# EAGLE design temp (EAGLE 7.1.0)
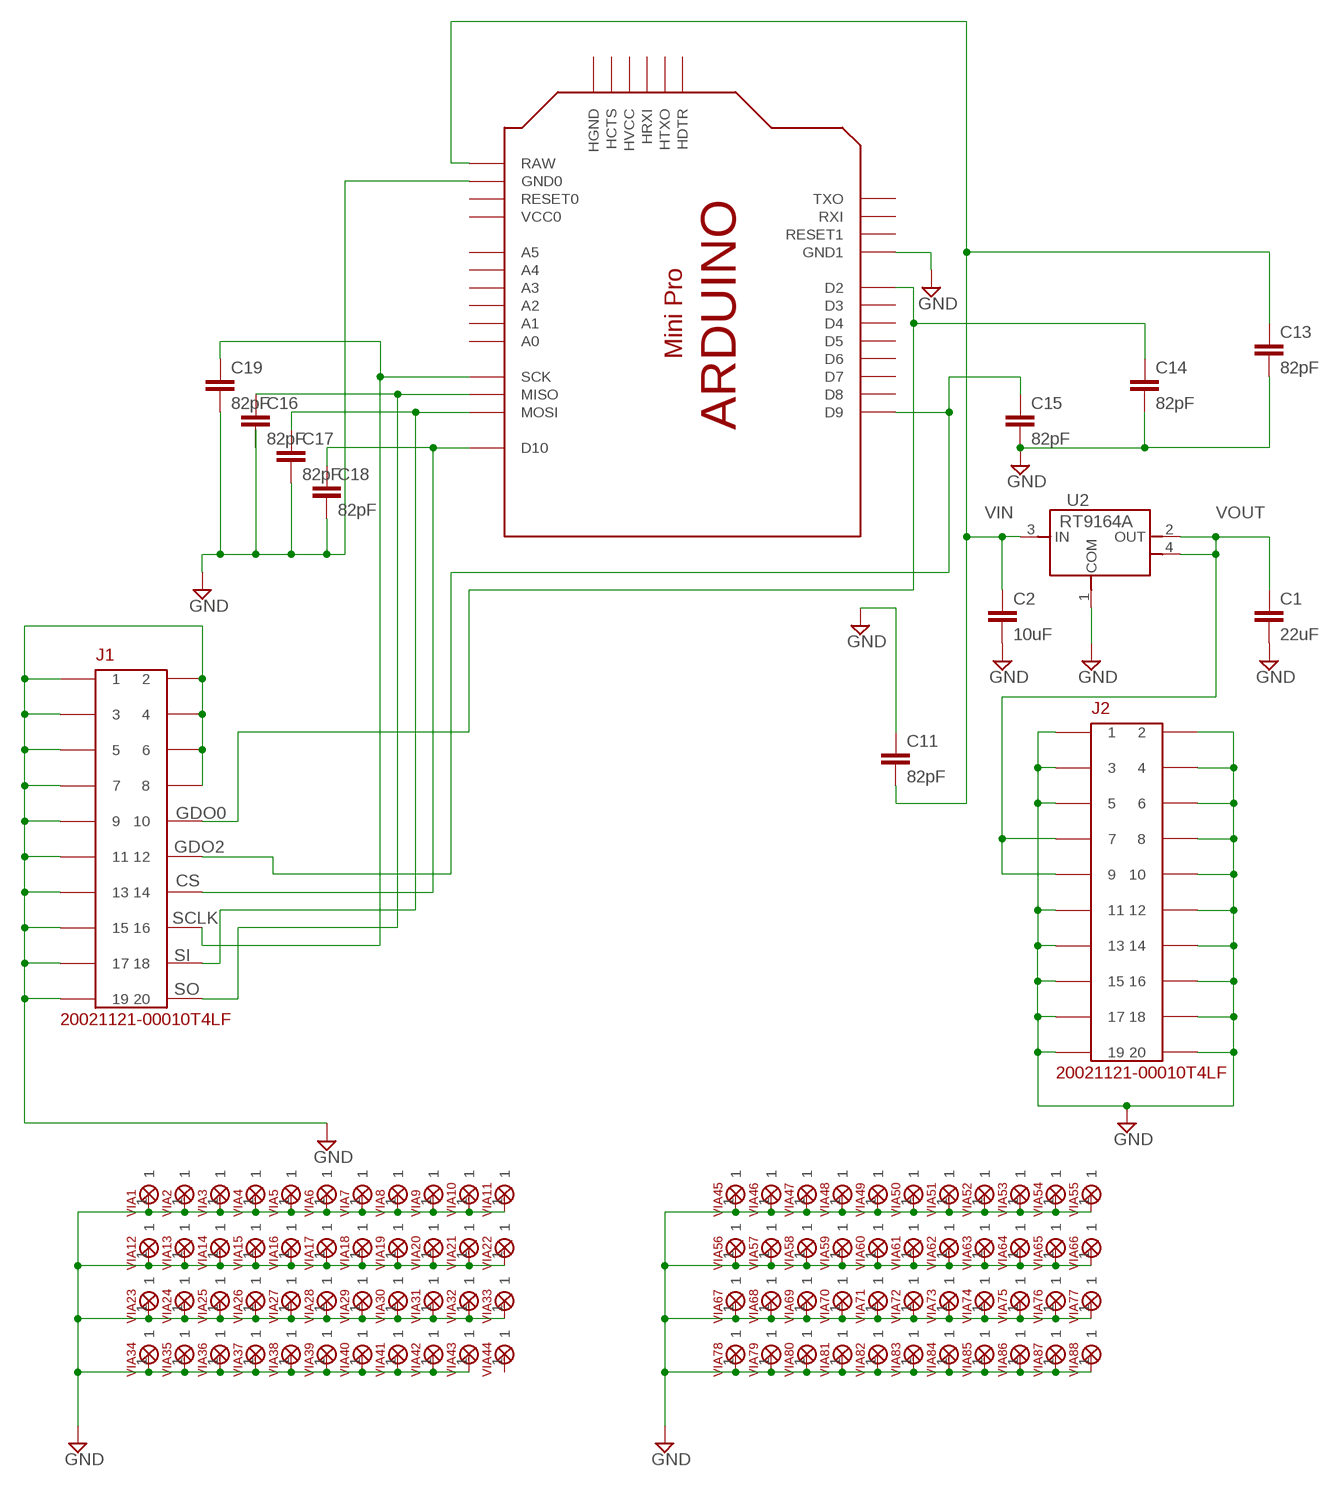
[diagram p0: schematic, sheet 1]

## Parts
C1  22uF  CC1206  [C1206]
C2  10uF  CC1206  [C1206]
C11  82pF  C  [C0805]
C13  82pF  C  [C0805]
C14  82pF  C  [C0805]
C15  82pF  C  [C0805]
C16  82pF  C  [C0805]
C17  82pF  C  [C0805]
C18  82pF  C  [C0805]
C19  82pF  C  [C0805]
J1  20021121-00010T4LF  [PINHDR10X2_50X50MIL_SMT]
J2  20021121-00010T4LF  [PINHDR10X2_50X50MIL_SMT]
U2  RT9164A  [TO223]
U$1  ARDUINOMINI  [ARDUINOMINI]
VIA1  GND_VIA_NO_THERMAL  [VIA_NO_THERMAL]
VIA2  GND_VIA_NO_THERMAL  [VIA_NO_THERMAL]
VIA3  GND_VIA_NO_THERMAL  [VIA_NO_THERMAL]
VIA4  GND_VIA_NO_THERMAL  [VIA_NO_THERMAL]
VIA5  GND_VIA_NO_THERMAL  [VIA_NO_THERMAL]
VIA6  GND_VIA_NO_THERMAL  [VIA_NO_THERMAL]
VIA7  GND_VIA_NO_THERMAL  [VIA_NO_THERMAL]
VIA8  GND_VIA_NO_THERMAL  [VIA_NO_THERMAL]
VIA9  GND_VIA_NO_THERMAL  [VIA_NO_THERMAL]
VIA10  GND_VIA_NO_THERMAL  [VIA_NO_THERMAL]
VIA11  GND_VIA_NO_THERMAL  [VIA_NO_THERMAL]
VIA12  GND_VIA_NO_THERMAL  [VIA_NO_THERMAL]
VIA13  GND_VIA_NO_THERMAL  [VIA_NO_THERMAL]
VIA14  GND_VIA_NO_THERMAL  [VIA_NO_THERMAL]
VIA15  GND_VIA_NO_THERMAL  [VIA_NO_THERMAL]
VIA16  GND_VIA_NO_THERMAL  [VIA_NO_THERMAL]
VIA17  GND_VIA_NO_THERMAL  [VIA_NO_THERMAL]
VIA18  GND_VIA_NO_THERMAL  [VIA_NO_THERMAL]
VIA19  GND_VIA_NO_THERMAL  [VIA_NO_THERMAL]
VIA20  GND_VIA_NO_THERMAL  [VIA_NO_THERMAL]
VIA21  GND_VIA_NO_THERMAL  [VIA_NO_THERMAL]
VIA22  GND_VIA_NO_THERMAL  [VIA_NO_THERMAL]
VIA23  GND_VIA_NO_THERMAL  [VIA_NO_THERMAL]
VIA24  GND_VIA_NO_THERMAL  [VIA_NO_THERMAL]
VIA25  GND_VIA_NO_THERMAL  [VIA_NO_THERMAL]
VIA26  GND_VIA_NO_THERMAL  [VIA_NO_THERMAL]
VIA27  GND_VIA_NO_THERMAL  [VIA_NO_THERMAL]
VIA28  GND_VIA_NO_THERMAL  [VIA_NO_THERMAL]
VIA29  GND_VIA_NO_THERMAL  [VIA_NO_THERMAL]
VIA30  GND_VIA_NO_THERMAL  [VIA_NO_THERMAL]
VIA31  GND_VIA_NO_THERMAL  [VIA_NO_THERMAL]
VIA32  GND_VIA_NO_THERMAL  [VIA_NO_THERMAL]
VIA33  GND_VIA_NO_THERMAL  [VIA_NO_THERMAL]
VIA34  GND_VIA_NO_THERMAL  [VIA_NO_THERMAL]
VIA35  GND_VIA_NO_THERMAL  [VIA_NO_THERMAL]
VIA36  GND_VIA_NO_THERMAL  [VIA_NO_THERMAL]
VIA37  GND_VIA_NO_THERMAL  [VIA_NO_THERMAL]
VIA38  GND_VIA_NO_THERMAL  [VIA_NO_THERMAL]
VIA39  GND_VIA_NO_THERMAL  [VIA_NO_THERMAL]
VIA40  GND_VIA_NO_THERMAL  [VIA_NO_THERMAL]
VIA41  GND_VIA_NO_THERMAL  [VIA_NO_THERMAL]
VIA42  GND_VIA_NO_THERMAL  [VIA_NO_THERMAL]
VIA43  GND_VIA_NO_THERMAL  [VIA_NO_THERMAL]
VIA44  GND_VIA_NO_THERMAL  [VIA_NO_THERMAL]
VIA45  GND_VIA_NO_THERMAL  [VIA_NO_THERMAL]
VIA46  GND_VIA_NO_THERMAL  [VIA_NO_THERMAL]
VIA47  GND_VIA_NO_THERMAL  [VIA_NO_THERMAL]
VIA48  GND_VIA_NO_THERMAL  [VIA_NO_THERMAL]
VIA49  GND_VIA_NO_THERMAL  [VIA_NO_THERMAL]
VIA50  GND_VIA_NO_THERMAL  [VIA_NO_THERMAL]
VIA51  GND_VIA_NO_THERMAL  [VIA_NO_THERMAL]
VIA52  GND_VIA_NO_THERMAL  [VIA_NO_THERMAL]
VIA53  GND_VIA_NO_THERMAL  [VIA_NO_THERMAL]
VIA54  GND_VIA_NO_THERMAL  [VIA_NO_THERMAL]
VIA55  GND_VIA_NO_THERMAL  [VIA_NO_THERMAL]
VIA56  GND_VIA_NO_THERMAL  [VIA_NO_THERMAL]
VIA57  GND_VIA_NO_THERMAL  [VIA_NO_THERMAL]
VIA58  GND_VIA_NO_THERMAL  [VIA_NO_THERMAL]
VIA59  GND_VIA_NO_THERMAL  [VIA_NO_THERMAL]
VIA60  GND_VIA_NO_THERMAL  [VIA_NO_THERMAL]
VIA61  GND_VIA_NO_THERMAL  [VIA_NO_THERMAL]
VIA62  GND_VIA_NO_THERMAL  [VIA_NO_THERMAL]
VIA63  GND_VIA_NO_THERMAL  [VIA_NO_THERMAL]
VIA64  GND_VIA_NO_THERMAL  [VIA_NO_THERMAL]
VIA65  GND_VIA_NO_THERMAL  [VIA_NO_THERMAL]
VIA66  GND_VIA_NO_THERMAL  [VIA_NO_THERMAL]
VIA67  GND_VIA_NO_THERMAL  [VIA_NO_THERMAL]
VIA68  GND_VIA_NO_THERMAL  [VIA_NO_THERMAL]
VIA69  GND_VIA_NO_THERMAL  [VIA_NO_THERMAL]
VIA70  GND_VIA_NO_THERMAL  [VIA_NO_THERMAL]
VIA71  GND_VIA_NO_THERMAL  [VIA_NO_THERMAL]
VIA72  GND_VIA_NO_THERMAL  [VIA_NO_THERMAL]
VIA73  GND_VIA_NO_THERMAL  [VIA_NO_THERMAL]
VIA74  GND_VIA_NO_THERMAL  [VIA_NO_THERMAL]
VIA75  GND_VIA_NO_THERMAL  [VIA_NO_THERMAL]
VIA76  GND_VIA_NO_THERMAL  [VIA_NO_THERMAL]
VIA77  GND_VIA_NO_THERMAL  [VIA_NO_THERMAL]
VIA78  GND_VIA_NO_THERMAL  [VIA_NO_THERMAL]
VIA79  GND_VIA_NO_THERMAL  [VIA_NO_THERMAL]
VIA80  GND_VIA_NO_THERMAL  [VIA_NO_THERMAL]
VIA81  GND_VIA_NO_THERMAL  [VIA_NO_THERMAL]
VIA82  GND_VIA_NO_THERMAL  [VIA_NO_THERMAL]
VIA83  GND_VIA_NO_THERMAL  [VIA_NO_THERMAL]
VIA84  GND_VIA_NO_THERMAL  [VIA_NO_THERMAL]
VIA85  GND_VIA_NO_THERMAL  [VIA_NO_THERMAL]
VIA86  GND_VIA_NO_THERMAL  [VIA_NO_THERMAL]
VIA87  GND_VIA_NO_THERMAL  [VIA_NO_THERMAL]
VIA88  GND_VIA_NO_THERMAL  [VIA_NO_THERMAL]

## Nets
CS: C18.1 J1.P$14 U$1.P$30(D10)
GDO0: C14.1 J1.P$10 U$1.P$8(D2)
GDO2: C15.1 J1.P$12 U$1.P$1(D9)
GND: C1.2 C2.2 C11.1 C13.2 C14.2 C15.2 C17.2 C18.2 C19.2 J1.P$1 J1.P$2 J1.P$3 J1.P$4 J1.P$5 J1.P$6 J1.P$7 J1.P$8 J1.P$9 J1.P$11 J1.P$13 J1.P$15 J1.P$17 J1.P$19 J2.P$1 J2.P$2 J2.P$3 J2.P$4 J2.P$5 J2.P$6 J2.P$8 J2.P$10 J2.P$11 J2.P$12 J2.P$13 J2.P$14 J2.P$15 J2.P$16 J2.P$17 J2.P$18 J2.P$19 J2.P$20 U2.1(COM) U$1.P$9(GND1) U$1.P$20(GND0) VIA1.1 VIA2.1 VIA3.1 VIA4.1 VIA5.1 VIA6.1 VIA7.1 VIA8.1 VIA9.1 VIA10.1 VIA11.1 VIA12.1 VIA13.1 VIA14.1 VIA15.1 VIA16.1 VIA17.1 VIA18.1 VIA19.1 VIA20.1 VIA21.1 VIA22.1 VIA23.1 VIA24.1 VIA25.1 VIA26.1 VIA27.1 VIA28.1 VIA29.1 VIA30.1 VIA31.1 VIA32.1 VIA33.1 VIA34.1 VIA35.1 VIA36.1 VIA37.1 VIA38.1 VIA39.1 VIA40.1 VIA41.1 VIA42.1 VIA43.1 VIA45.1 VIA46.1 VIA47.1 VIA48.1 VIA49.1 VIA50.1 VIA51.1 VIA52.1 VIA53.1 VIA54.1 VIA55.1 VIA56.1 VIA57.1 VIA58.1 VIA59.1 VIA60.1 VIA61.1 VIA62.1 VIA63.1 VIA64.1 VIA65.1 VIA66.1 VIA67.1 VIA68.1 VIA69.1 VIA70.1 VIA71.1 VIA72.1 VIA73.1 VIA74.1 VIA75.1 VIA76.1 VIA77.1 VIA78.1 VIA79.1 VIA80.1 VIA81.1 VIA82.1 VIA83.1 VIA84.1 VIA85.1 VIA86.1 VIA87.1 VIA88.1
SCLK: C19.1 J1.P$16 U$1.P$27(SCK)
SI: C17.1 J1.P$18 U$1.P$29(MOSI)
SO: C16.1 J1.P$20 U$1.P$28(MISO)
VIN: C2.1 C11.2 C13.1 U2.3(IN) U$1.P$19(RAW)
VOUT: C1.1 J2.P$7 J2.P$9 U2.2(OUT) U2.4(OUT)
Unconnected: C16.2 U$1.P$2(D8) U$1.P$3(D7) U$1.P$4(D6) U$1.P$5(D5) U$1.P$6(D4) U$1.P$7(D3) U$1.P$10(RESET1) U$1.P$11(RXI) U$1.P$12(TXO) U$1.P$13(HDTR) U$1.P$14(HTXO) U$1.P$15(HRXI) U$1.P$16(HVCC) U$1.P$17(HCTS) U$1.P$18(HGND) U$1.P$21(RESET0) U$1.P$22(VCC0) U$1.P$23(A3) U$1.P$24(A2) U$1.P$25(A1) U$1.P$26(A0) U$1.P$34(A4) U$1.P$35(A5) VIA44.1

## Library data of the parts
C1 C2 C11 C13-C19 = eagle-ltspice:C: CAPACITOR, European symbol; SPICEMODEL: NONE; SPICEPREFIX: C
J1 J2 = fhpower:20021121-00010T4LF: 2x10 50mil Male Pin Header Unshrouded
U2 = fhpower:RT9164A
U$1 = fhdevices:ARDUINOMINI
VIA1-VIA88 = fhmechanical:GND_VIA_NO_THERMAL

## Board
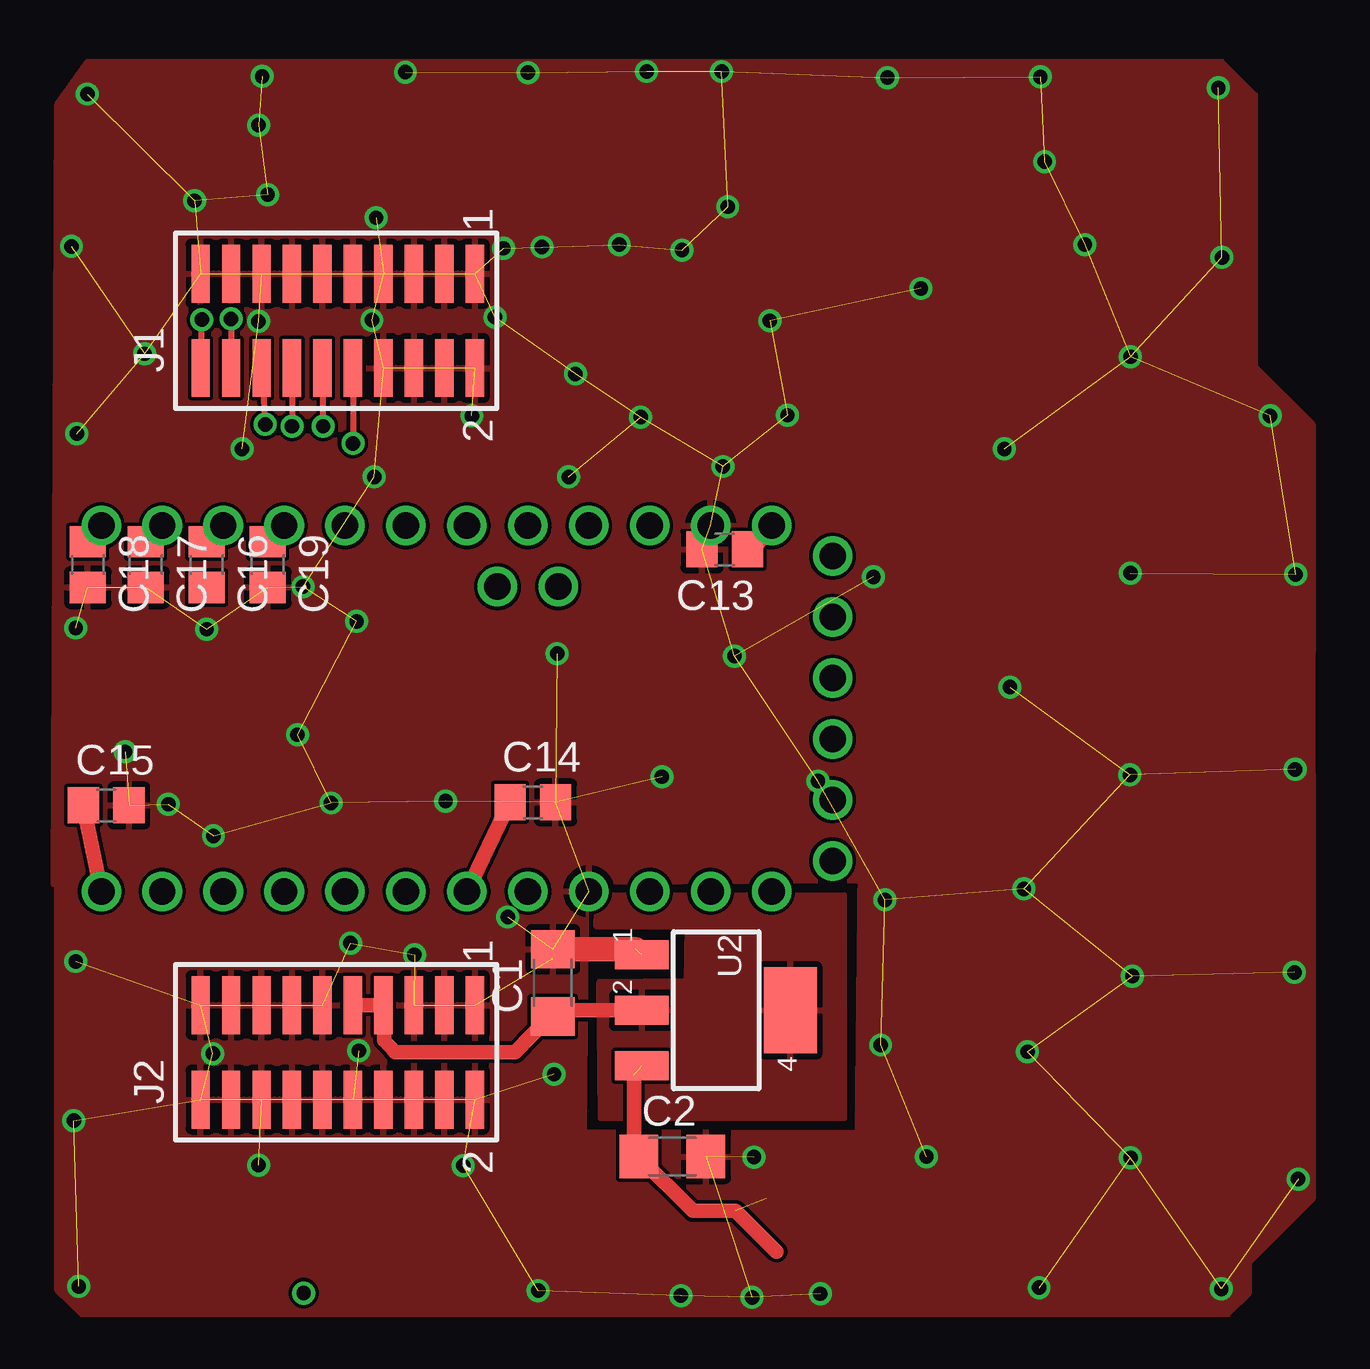
[diagram p1: board, top side]
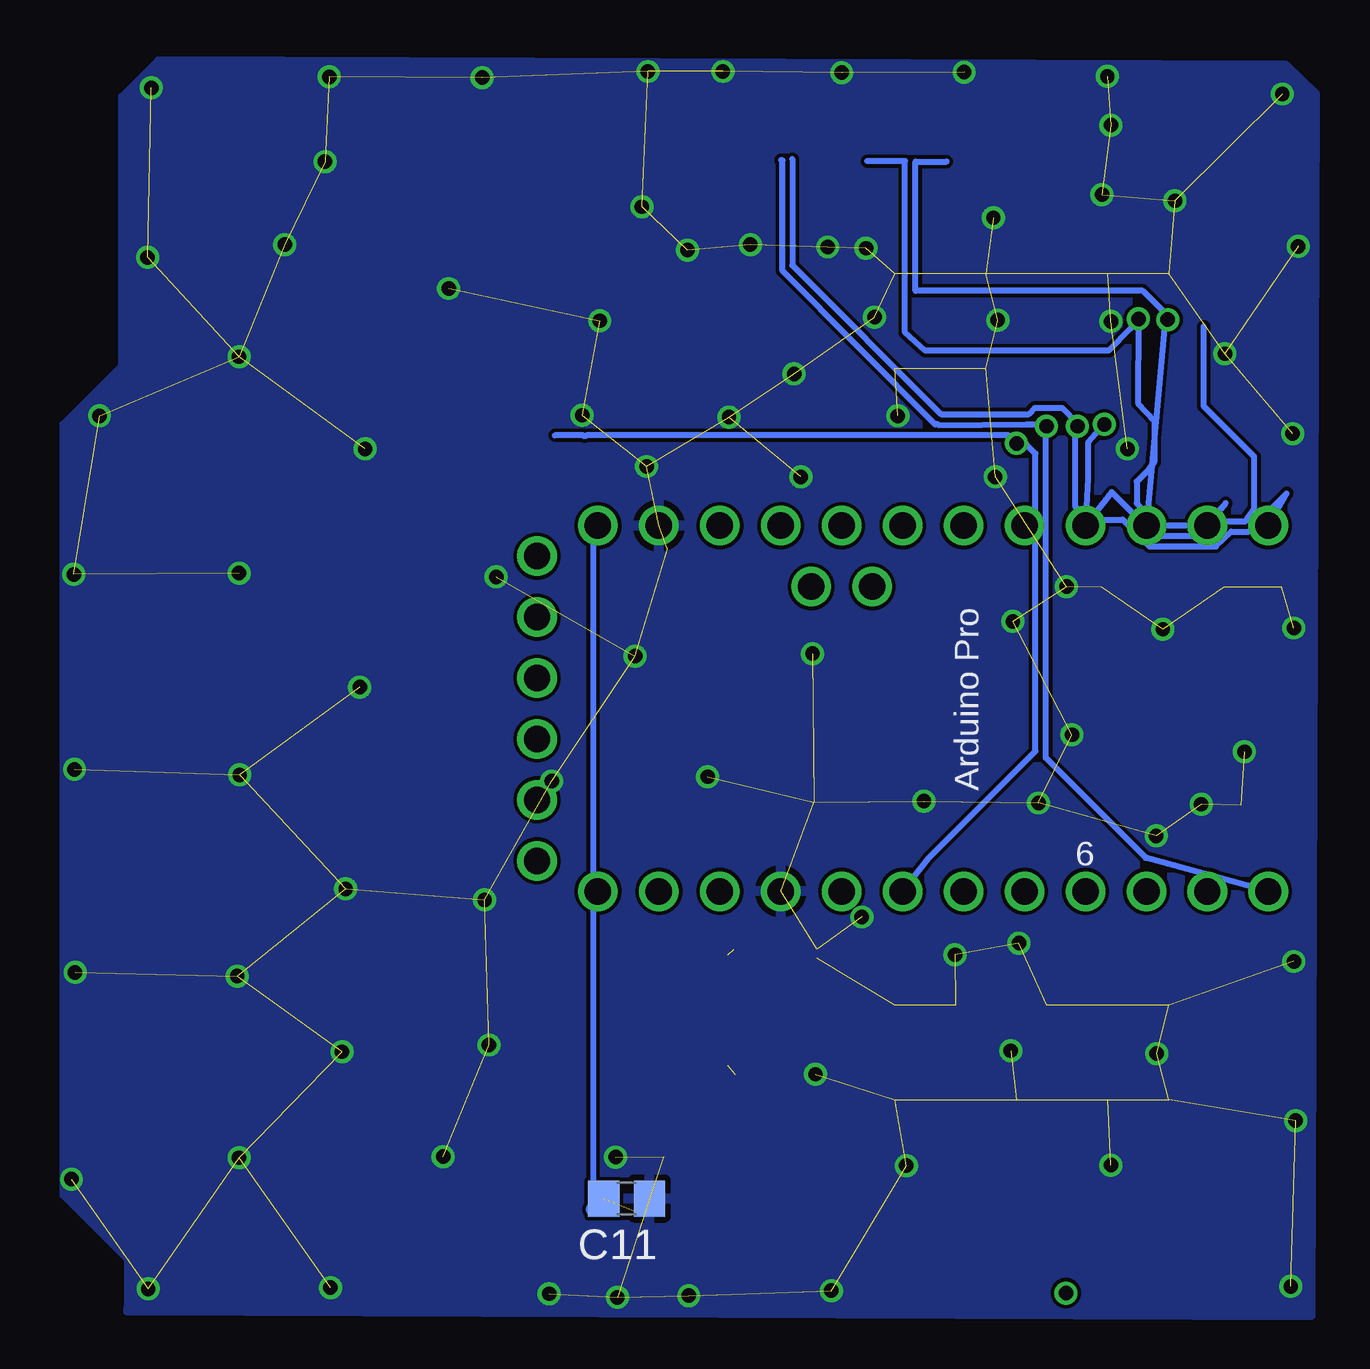
[diagram p2: board, bottom side, seen from below]

No outline drawn. Coordinates in mm, seen from the top.
Copper layers (1*16): Top 0.0356mm / dielectric 1.5011mm / Bottom 0.0356mm
Design rules "LaenPCBOrder": minimum track width 6mil, minimum drill 13mil, track to track 6mil, track to pad 6mil, pad to pad 6mil, via to via 6mil, smd to smd 6mil, copper to edge 15mil, drill to drill 6mil, minimum pad ring 7mil, minimum via ring 7mil, stop-mask expansion 4mil, vias tented up to drill 0mil, thermal gap 10mil

### Footprints (pad centres in the part's own frame; a part is rotated, then mirrored left to right if it is on the bottom)
C1206 = smd 1.6 x 1.8: 1 -1.4,0; 2 1.4,0
C0805 = smd 1.3 x 1.5: 1 -0.95,0; 2 0.95,0
PINHDR10X2_50X50MIL_SMT = smd 2.413 x 0.762: P$1 -1.968,5.715; P$2 1.968,5.715; P$3 -1.968,4.445; P$4 1.968,4.445; P$5 -1.968,3.175; P$6 1.968,3.175; P$7 -1.968,1.905; P$8 1.968,1.905; P$9 -1.968,0.635; P$10 1.968,0.635; P$11 -1.968,-0.635; P$12 1.968,-0.635; P$13 -1.968,-1.905; P$14 1.968,-1.905; P$15 -1.968,-3.175; P$16 1.968,-3.175; P$17 -1.968,-4.445; P$18 1.968,-4.445; P$19 -1.968,-5.715; P$20 1.968,-5.715
TO223 = smd 1.219 x 2.235: 1 -2.311,-3.099; 2 0,-3.099; 3 2.311,-3.099 | smd 3.6 x 2.2: 4 0,3.099
ARDUINOMINI = drill 1.1: P$1 -7.62,-13.97; P$2 -7.62,-11.43; P$3 -7.62,-8.89; P$4 -7.62,-6.35; P$5 -7.62,-3.81; P$6 -7.62,-1.27; P$7 -7.62,3.81; P$8 -7.62,1.27; P$9 -7.62,6.35; P$10 -7.62,8.89; P$11 -7.62,11.43; P$12 -7.62,13.97; P$13 -6.35,16.51; P$14 -3.81,16.51; P$15 -1.27,16.51; P$16 1.27,16.51; P$17 3.81,16.51; P$18 6.35,16.51; P$19 7.62,13.97; P$20 7.62,11.43; P$21 7.62,8.89; P$22 7.62,6.35; P$23 7.62,3.81; P$24 7.62,1.27; P$25 7.62,-1.27; P$26 7.62,-3.81; P$27 7.62,-6.35; P$28 7.62,-8.89; P$29 7.62,-11.43; P$30 7.62,-13.97; P$34 5.08,5.08; P$35 5.08,2.54
VIA_NO_THERMAL = drill 0.6: 1 0,0

### Placement (x,y rotation side)
C1  21.16,14.2 90 top
C2  26.14,6.96 0 top
C11  29.08,5.21 180 bottom
C13  28.32,32.26 180 top
C14  20.32,21.72 0 top
C15  2.54,21.59 0 top
C16  6.73,31.62 270 top
C17  4.19,31.62 270 top
C18  1.78,31.62 270 top
C19  9.27,31.62 270 top
J1  12.19,41.78 270 top
J2  12.19,11.3 270 top
U2  27.97,13.06 270 top
U$1  16.31,25.63 90 bottom
VIA1  4.14,40.41 0 top
VIA2  8.89,41.76 0 top
VIA3  1.75,51.23 0 top
VIA4  8.89,49.94 0 top
VIA5  15.01,52.15 0 top
VIA6  20.12,52.12 0 top
VIA7  25.07,52.17 0 top
VIA8  6.22,46.79 0 top
VIA9  23.93,44.96 0 top
VIA10  26.54,44.73 0 top
VIA11  20.7,44.86 0 top
VIA12  19.1,44.81 0 top
VIA13  13.79,46.08 0 top
VIA14  18.75,41.94 0 top
VIA15  28.19,52.17 0 top
VIA16  35.1,51.92 0 top
VIA17  41.48,51.94 0 top
VIA18  48.9,51.49 0 top
VIA19  49.05,44.42 0 top
VIA20  51.05,37.82 0 top
VIA21  52.12,31.22 0 top
VIA22  52.1,23.09 0 top
VIA23  52.07,14.63 0 top
VIA24  6.73,28.93 0 top
VIA25  1.32,37.08 0 top
VIA26  41.66,48.41 0 top
VIA27  52.22,6.02 0 top
VIA28  13.07,11.37 0 top
VIA29  17.78,37.82 0 top
VIA30  22.1,39.57 90 top
VIA31  49.02,1.45 0 top
VIA32  13.72,35.28 0 top
VIA33  24.82,37.77 0 top
VIA34  28.24,35.71 0 top
VIA35  41.43,1.5 0 top
VIA36  3.33,23.83 0 top
VIA37  21.34,27.91 0 top
VIA38  8.2,36.45 0 top
VIA39  32.31,1.24 0 top
VIA40  1.4,1.55 0 top
VIA41  11.91,21.69 0 top
VIA42  1.27,15.09 0 top
VIA43  20.55,1.37 0 top
VIA44  10.77,1.27 0 top
VIA45  26.49,1.17 0 top
VIA46  1.19,8.46 0 top
VIA47  8.89,6.6 0 top
VIA48  12.73,15.85 0 top
VIA49  16.69,21.77 0 top
VIA50  34.82,11.61 0 top
VIA51  29.54,6.93 0 top
VIA52  21.21,10.39 0 top
VIA53  17.42,6.58 0 top
VIA54  10.52,24.54 0 top
VIA55  15.39,15.37 0 top
VIA56  6.99,11.25 0 top
VIA57  29.46,1.09 0 top
VIA58  35,17.65 0 top
VIA59  32.21,22.61 0 top
VIA60  30.2,41.78 90 top
VIA61  36.73,6.96 0 top
VIA62  45.24,6.91 0 top
VIA63  43.33,44.96 0 top
VIA64  28.73,27.81 0 top
VIA65  45.24,40.28 0 top
VIA66  45.24,31.27 0 top
VIA67  45.21,22.86 0 top
VIA68  45.31,14.48 0 top
VIA69  36.5,43.13 0 top
VIA70  34.52,31.11 0 top
VIA71  12.98,29.26 0 top
VIA72  9.27,47.04 0 top
VIA73  39.98,36.45 0 top
VIA74  13.61,41.81 0 top
VIA75  30.94,37.85 0 top
VIA76  21.82,35.28 0 top
VIA77  1.09,44.88 0 top
VIA78  10.74,30.71 0 top
VIA79  9.04,51.97 0 top
VIA80  40.21,26.52 0 top
VIA81  5.13,21.64 0 top
VIA82  28.45,46.53 0 top
VIA83  1.27,28.98 0 top
VIA84  25.7,22.78 0 top
VIA85  40.94,11.33 0 top
VIA86  40.79,18.11 0 top
VIA87  7.01,20.32 90 top
VIA88  19.28,16.94 270 top

### Tracks (layer width: path | path; a pad name or v marks a point on that pad's centre or on a via)
CS  (via drill 0.6)
  Top 0.254: J1.P$14 v10.29,37.39
  Top 0.61: C18.1 1.57,32.57 U$1.P$30
  Bottom 0.254: U$1.P$30 1.57,34.59 3.15,32.99 3.89,32.99 4.52,32.38 7.29,32.38 8.41,33.5 9.78,33.5 10.29,33.96 10.39,34.06 10.39,37.24 10.26,37.36 10.26,37.44 v10.29,37.39 10.29,37.52 10.92,38.15 12.06,38.15 12.32,37.9 15.98,37.9 22.17,44.09 22.17,48.52
GDO0  (via drill 0.6)
  Top 0.254: J1.P$10 v12.83,36.68
  Top 0.61: C14.1 19.36,21.72 U$1.P$8
  Bottom 0.254: 32.07,37.01 30.89,37.01 arc-90 30.76,37.01 13.16,37.01 v12.83,36.68 12.47,36.68 12.04,36.25 12.04,23.85 16.48,19.41 U$1.P$8
GDO2  (via drill 0.6)
  Top 0.254: v11.58,37.39 11.58,37.57 J1.P$12
  Top 0.61: C15.1 1.57,21.59 U$1.P$1
  Bottom 0.254: 22.65,48.47 22.58,48.46 22.58,43.87 16.23,37.47 16.1,37.47 16.08,37.44 12.42,37.47 11.66,37.47 v11.58,37.39 11.61,37.36 11.61,23.57 7.44,19.41 U$1.P$1
GND  (130 unrouted)
  Top 0.254: 21.16,15.21 C1.2
  Top 1.016: 24.61,15.6 C1.2
  pour Bottom: 0.38,51.23 1.6,52.4 48.56,52.6 50.09,51.08 50.09,39.88 52.53,37.44 52.53,5.38 49.83,2.69 49.83,0.66 49.94,0.56 0.56,0.36
  pour Top: 22.43,8 33.88,7.95 34.04,22.73 52.83,22.86 52.83,5.21 50.16,2.54 50.16,1.27 49.28,0.38 1.55,0.38 0.51,1.4 0.51,22.86 22.58,22.78
  pour Top: 1.78,52.58 49.02,52.58 50.42,51.18 50.42,39.88 52.83,37.47 52.81,18.54 0.36,18.29 0.51,50.8
SCLK  (via drill 0.6)
  Top 0.254: J1.P$16 v9.17,37.47
  Top 0.61: C19.1 9.2,32.57 U$1.P$27
  Bottom 0.254: 5.03,41.54 5.03,38.23 2.92,36.12 2.92,33.96 3.3,33.43 4.12,33.43 4.72,32.82 7.04,32.82 8.87,34.65 U$1.P$27 9.86,35.23 9.86,36.7 v9.17,37.47
SI  (via drill 0.6)
  Top 0.254: v7.75,41.86 J1.P$18
  Top 0.61: C17.1 4.12,32.57 U$1.P$29
  Bottom 0.254: v7.75,41.86 7.75,41.91 | 7.75,41.91 8.08,41.45 8.99,40.54 16.64,40.54 17.48,41.3 17.48,48.44 19.05,48.44 | 7.75,41.91 7.77,38.35 7.09,37.62 7.09,35.89 7.29,35.64 7.32,35.59 7.82,35.08 7.82,34.19 7.77,34.14 6.81,33.25 5.05,33.25 4.12,34.19 U$1.P$29
SO  (via drill 0.6)
  Top 0.254: J1.P$20 6.53,39.87 v6.53,41.83
  Top 0.61: C16.1 6.66,32.57 U$1.P$28
  Bottom 0.254: v6.53,41.83 6.66,41.71 | 6.66,41.71 U$1.P$28 | 6.66,41.71 6.66,42.11 7.57,43.03 17.04,43.03 17.04,48.41 15.75,48.41
VIN  (2 unrouted)
  Top 0.61: 24.54,10.36 24.54,7.47 C2.1 27,4.7 28.78,4.7 30.48,3 | C13.1 29.52,32.26 U$1.P$19
  Bottom 0.254: U$1.P$19 30.48,33.68 30.48,4.76
  Bottom 0.61: 30.48,4.76 C11.2
VOUT
  Top 0.254: 21.03,12.8 C1.1
  Top 0.61: J2.P$9 J2.P$7 14.12,13.25 14.12,11.81 14.58,11.3 19.59,11.3 21.03,12.8 | C1.1 21.41,13.06 U2.2
  Top 1.27: 21.11,12.88 C1.1 21.14,12.9
  pour Top: 33.3,8.56 23.16,8.56 23.11,14.25 26.75,14.27 26.8,16.54 22.99,16.54 23.01,17.86 33.27,17.86